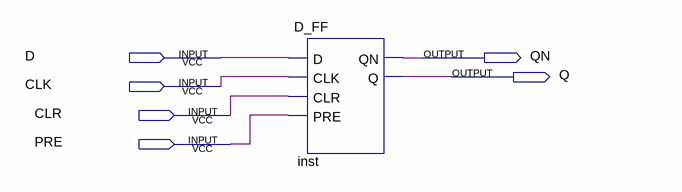
[diagram p0: schematic sheet]
// Quartus schematic lab13_2.bdf as structural Verilog: 1 symbols, 6 pins
module lab13_2 (
  input  D,
  input  CLK,
  input  CLR,
  input  PRE,
  output QN,
  output Q
);

  D_FF inst (.D(D), .CLK(CLK), .CLR(CLR), .PRE(PRE), .QN(QN), .Q(Q));
endmodule
